# Altium schematic sheet HDMI2_0_RX.SchDoc
size 420 x 297 mm; SheetNumber: 20; SheetTotal: 23
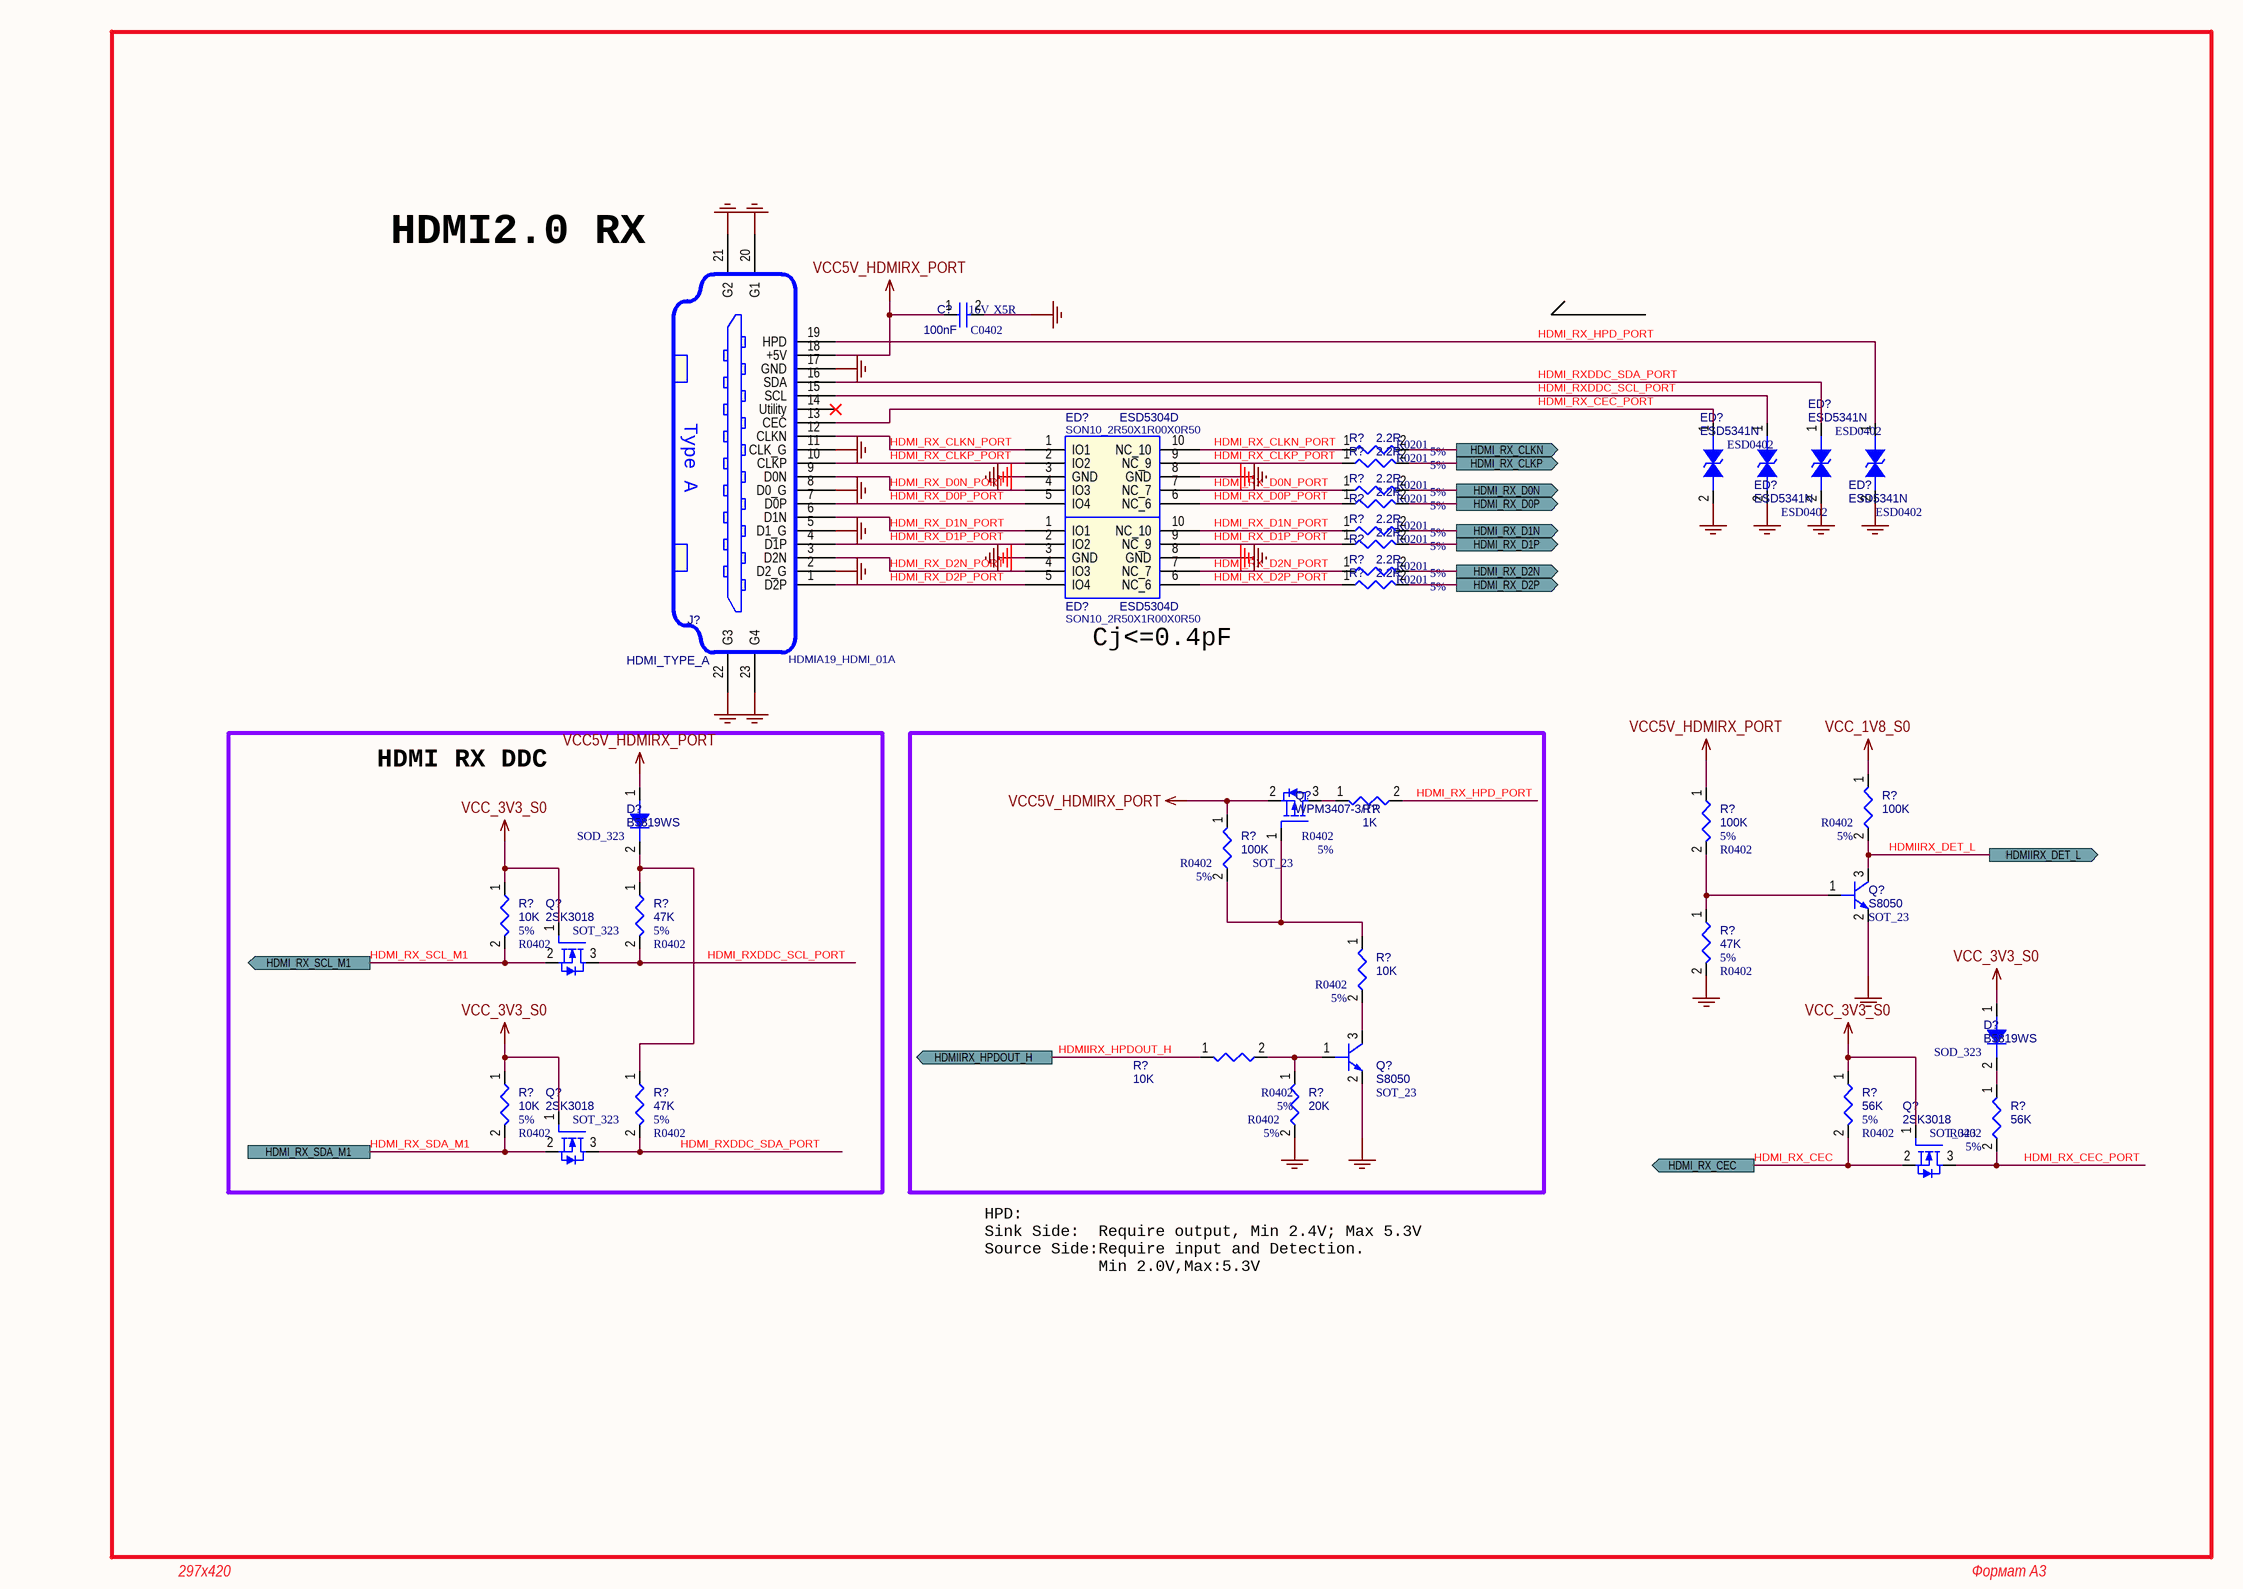
[diagram p0: HDMI2_0_RX.SchDoc]

## Parts
(Parts that share a designator on the sheet are numbered #1, #2 ... from top to bottom, then left to right.)
C?  100nF  Dielectric: X5R  Voltage: 16V  [C0402]
D?#1  B5819WS  [SOD_323]
D?#2  B5819WS  [SOD_323]
ED?#1  ESD5304D  [SON10_2R50X1R00X0R50]
ED?#2  ESD5341N  [ESD0402]
ED?#3  ESD5341N  [ESD0402]
ED?#4  ESD5341N  [ESD0402]
ED?#5  ESD5341N  [ESD0402]
ED?#6  ESD5304D  [SON10_2R50X1R00X0R50]
J?  HDMI_TYPE_A  [HDMIA19_HDMI_01A]
Q?#1  WPM3407-3/TR  PCB Footprint: SOT_23  [SOT23]
Q?#2  S8050  [SOT_23]
Q?#3  2SK3018  PCB Footprint: SOT_323  [SOT23]
Q?#4  S8050  [SOT_23]
Q?#5  2SK3018  PCB Footprint: SOT_323  [SOT23]
Q?#6  2SK3018  PCB Footprint: SOT_323  [SOT23]
R?#1  2.2R  Tolerance: 5%  PCB Footprint: R0201  [R0402]
R?#2  2.2R  Tolerance: 5%  PCB Footprint: R0201  [R0402]
R?#3  2.2R  Tolerance: 5%  PCB Footprint: R0201  [R0402]
R?#4  2.2R  Tolerance: 5%  PCB Footprint: R0201  [R0402]
R?#5  2.2R  Tolerance: 5%  PCB Footprint: R0201  [R0402]
R?#6  2.2R  Tolerance: 5%  PCB Footprint: R0201  [R0402]
R?#7  2.2R  Tolerance: 5%  PCB Footprint: R0201  [R0402]
R?#8  2.2R  Tolerance: 5%  PCB Footprint: R0201  [R0402]
R?#9  1K  Tolerance: 5%  [R0402]
R?#10  100K  Tolerance: 5%  [R0402]
R?#11  100K  Tolerance: 5%  [R0402]
R?#12  100K  Tolerance: 5%  [R0402]
R?#13  10K  Tolerance: 5%  [R0402]
R?#14  47K  Tolerance: 5%  [R0402]
R?#15  47K  Tolerance: 5%  [R0402]
R?#16  10K  Tolerance: 5%  [R0402]
R?#17  10K  Tolerance: 5%  [R0402]
R?#18  10K  Tolerance: 5%  [R0402]
R?#19  47K  Tolerance: 5%  [R0402]
R?#20  20K  Tolerance: 5%  [R0402]
R?#21  56K  Tolerance: 5%  [R0402]
R?#22  56K  Tolerance: 5%  [R0402]

## Blocks framed on the sheet
HDMI RX DDC: D?#1 Q?#3 Q?#5 R?#13 R?#14 R?#18 R?#19

## Ports
HDMI_RX_CEC (out, see RK3588_GPIO_MAYBE_IMPORTANT_PINS[2B]), HDMI_RX_CLKN (out, see RK3588_HDMI[3B]), HDMI_RX_CLKP (out, see RK3588_HDMI[3B]), HDMI_RX_D0N (out, see RK3588_HDMI[3A]), HDMI_RX_D0P (out, see RK3588_HDMI[3A]), HDMI_RX_D1N (out, see RK3588_HDMI[3A]), HDMI_RX_D1P (out, see RK3588_HDMI[3A]), HDMI_RX_D2N (out, see RK3588_HDMI[3B]), HDMI_RX_D2P (out, see RK3588_HDMI[3A]), HDMI_RX_SCL_M1 (out, see RK3588_GPIO_MAYBE_IMPORTANT_PINS[2B]), HDMI_RX_SDA_M1 (see RK3588_GPIO_MAYBE_IMPORTANT_PINS[2B]), HDMIIRX_DET_L (out, see RK3588_BOOTLOADER_MAYBE_SDIO[2B]), HDMIIRX_HPDOUT_H (out, see RK3588_GPIO_MAYBE_IMPORTANT_PINS[2B])

## Nets
GND: C?.2 ED?#1.3(GND) ED?#1.8(GND) ED?#2.2 ED?#3.2 ED?#4.2 ED?#5.2 ED?#6.3(GND) ED?#6.8(GND) J?.2(D2_G) J?.5(D1_G) J?.8(D0_G) J?.11(CLK_G) J?.17(GND) J?.20(G1) J?.21(G2) J?.22(G3) J?.23(G4) Q?#2.2(EMITTER) Q?#4.2(EMITTER) R?#15.2 R?#20.2
VCC5V_HDMIRX_PORT: C?.1 D?#1.1(A) J?.18(+5V) Q?#1.2(SOURCE) R?#11.1 R?#12.1
VCC_1V8_S0: R?#10.1
VCC_3V3_S0: D?#2.1(A) Q?#3.1(GATE) Q?#5.1(GATE) Q?#6.1(GATE) R?#13.1 R?#18.1 R?#21.1
HDMI_RX_CEC: Q?#6.2(SOURCE) R?#21.2 ; port HDMI_RX_CEC
HDMI_RX_CEC_PORT: ED?#2.1 J?.13(CEC) Q?#6.3(DRAIN) R?#22.2
HDMI_RX_CLKN: R?#1.2 ; port HDMI_RX_CLKN
HDMI_RX_CLKN_PORT: ED?#1.1(IO1) ED?#1.10(NC_10) J?.12(CLKN) R?#1.1
HDMI_RX_CLKP: R?#2.2 ; port HDMI_RX_CLKP
HDMI_RX_CLKP_PORT: ED?#1.2(IO2) ED?#1.9(NC_9) J?.10(CLKP) R?#2.1
HDMI_RX_D0N: R?#3.2 ; port HDMI_RX_D0N
HDMI_RX_D0N_PORT: ED?#1.4(IO3) ED?#1.7(NC_7) J?.9(D0N) R?#3.1
HDMI_RX_D0P: R?#4.2 ; port HDMI_RX_D0P
HDMI_RX_D0P_PORT: ED?#1.5(IO4) ED?#1.6(NC_6) J?.7(D0P) R?#4.1
HDMI_RX_D1N: R?#5.2 ; port HDMI_RX_D1N
HDMI_RX_D1N_PORT: ED?#6.1(IO1) ED?#6.10(NC_10) J?.6(D1N) R?#5.1
HDMI_RX_D1P: R?#6.2 ; port HDMI_RX_D1P
HDMI_RX_D1P_PORT: ED?#6.2(IO2) ED?#6.9(NC_9) J?.4(D1P) R?#6.1
HDMI_RX_D2N: R?#7.2 ; port HDMI_RX_D2N
HDMI_RX_D2N_PORT: ED?#6.4(IO3) ED?#6.7(NC_7) J?.3(D2N) R?#7.1
HDMI_RX_D2P: R?#8.2 ; port HDMI_RX_D2P
HDMI_RX_D2P_PORT: ED?#6.5(IO4) ED?#6.6(NC_6) J?.1(D2P) R?#8.1
HDMI_RX_HPD_PORT: ED?#5.1 J?.19(HPD) R?#9.2
HDMI_RX_SCL_M1: Q?#3.2(SOURCE) R?#13.2 ; port HDMI_RX_SCL_M1
HDMI_RX_SDA_M1: Q?#5.2(SOURCE) R?#18.2 ; port HDMI_RX_SDA_M1
HDMI_RXDDC_SCL_PORT: ED?#3.1 J?.15(SCL) Q?#3.3(DRAIN) R?#14.2
HDMI_RXDDC_SDA_PORT: ED?#4.1 J?.16(SDA) Q?#5.3(DRAIN) R?#19.2
HDMIIRX_DET_L: Q?#2.3(COLLECTOR) R?#10.2 ; port HDMIIRX_DET_L
HDMIIRX_HPDOUT_H: R?#17.1 ; port HDMIIRX_HPDOUT_H
NetD?#1_2: D?#1.2(K) R?#14.1 R?#19.1
NetD?#2_2: D?#2.2(K) R?#22.1
NetQ?#1_1: Q?#1.1(GATE) R?#12.2 R?#16.1
NetQ?#1_3: Q?#1.3(DRAIN) R?#9.1
NetQ?#2_1: Q?#2.1(BASE) R?#11.2 R?#15.1
NetQ?#4_1: Q?#4.1(BASE) R?#17.2 R?#20.1
NetQ?#4_3: Q?#4.3(COLLECTOR) R?#16.2

Not connected (* = marked no-connect by the designer): J? 14(Utility)*

## Notes on the sheet
- HDMI2.0 RX
- (near ED?#6) Cj<=0.4pF
- HPD:
  Sink Side:  Require output, Min 2.4V; Max 5.3V
  Source Side:Require input and Detection.
  Min 2.0V,Max:5.3V
- 297x420
- Формат А3
- (in symbol HDMI_TYPE_A_0) Type A

## Library data of the parts
C? = CAP NP_Dup1: cap,100.00nF,+/-10%,16V,X5R,C0402; Part Reference: C4900; Manufacturer PN: C1005X5R1C104K050BA; Manufacturer: TDK; C_Voltage: 10V; Tolerance: 10%; Priority: A; Number: 37; PCB Footprint: C0402; Value: 100nF; Created by: JJJ; Part Type: C0402; RK PN: C1005X5R1C104K050BA
D?#1 = DIODE: Schottky BarrierЈ¬B5819WS SOD-323; Part Reference: D4900; Manufacturer: і¤µз; Priority: A; PCB Footprint: SOD_323; Value: B5819WS; Created by: JJJ; Manufacturer PN: B5819WS; Part Type: Schottky rectifier; RK PN: B5819WS
D?#2 = DIODE: Schottky BarrierЈ¬B5819WS SOD-323; Part Reference: D4901; Manufacturer: і¤µз; Priority: A; PCB Footprint: SOD_323; Value: B5819WS; RK PN: B5819WS; Part Type: Schottky rectifier; Manufacturer PN: B5819WS; Created by: JJJ
ED?#1 = ESD_ESD5304D: 4-Lines, Uni-directional, Ultra-low Capacitance Transient Voltage Suppressors; Part Reference: ED4900; Manufacturer: WillSemi(О¤¶ы°лµјМе); Priority: A; PCB Footprint: SON10_2R50X1R00X0R50; Value: ESD5304D; Created by: JJJ; Manufacturer PN: ESD5304D; Part Type: ESD_TVS; RK PN: ESD5304D
ED?#2 = DIODE BI_DIR TRIG: 1-Line, Bi-directional, Transient Voltage Suppressors.1pF.; Part Reference: ED4901; Manufacturer: WillSemi(О¤¶ы°лµјМе); Priority: A; PCB Footprint: ESD0402; Value: ESD5341N; Created by: JJJ; Manufacturer PN: ESD5341N; Part Type: ESD_TVS; RK PN: ESD5341N
ED?#3 = DIODE BI_DIR TRIG: 1-Line, Bi-directional, Transient Voltage Suppressors.1pF.; Part Reference: ED4902; Manufacturer: WillSemi(О¤¶ы°лµјМе); Priority: A; PCB Footprint: ESD0402; Value: ESD5341N; Created by: JJJ; Manufacturer PN: ESD5341N; Part Type: ESD_TVS; RK PN: ESD5341N
ED?#4 = DIODE BI_DIR TRIG: 1-Line, Bi-directional, Transient Voltage Suppressors.1pF.; Part Reference: ED4903; Manufacturer: WillSemi(О¤¶ы°лµјМе); Priority: A; PCB Footprint: ESD0402; Value: ESD5341N; RK PN: ESD5341N; Part Type: ESD_TVS; Manufacturer PN: ESD5341N; Created by: JJJ
ED?#5 = DIODE BI_DIR TRIG: 1-Line, Bi-directional, Transient Voltage Suppressors.1pF.; Part Reference: ED4904; Manufacturer: WillSemi(О¤¶ы°лµјМе); Priority: A; PCB Footprint: ESD0402; Value: ESD5341N; Created by: JJJ; Manufacturer PN: ESD5341N; Part Type: ESD_TVS; RK PN: ESD5341N
ED?#6 = ESD_ESD5304D: 4-Lines, Uni-directional, Ultra-low Capacitance Transient Voltage Suppressors; Part Reference: ED4905; Manufacturer: WillSemi(О¤¶ы°лµјМе); Priority: A; PCB Footprint: SON10_2R50X1R00X0R50; Value: ESD5304D; Created by: JJJ; Manufacturer PN: ESD5304D; Part Type: ESD_TVS; RK PN: ESD5304D
J? = HDMI_TYPE_A_0: Part Reference: J4900; Value: HDMI_TYPE_A; PCB Footprint: HDMIA19_HDMI_01A
Q?#1 = MOSFET P_Dup1: PMOS,WPM3407-3/TR,SOT_23,Id=4.4A,Vds=30V; Part Reference: Q4901; Manufacturer: WillSemi(О¤¶ы°лµјМе); Pd: 0.9W; Vgsth: 2.0V; VDS: 30V; Vgs: ЎА20V; Id_max: 4.4A; Priority: A; Value: WPM3407-3/TR; Created by: JJJ; Manufacturer PN: WPM3407-3/TR; Part Type: PMOS; RK PN: WPM3407-3/TR
Q?#2 = NPN: S8050,SOT23; Part Reference: Q4900; Manufacturer PN: S8050_SOT23; Manufacturer: і¤µз; Pc: 0.3W; Vceo: 25V; Ic: 0.5A; Priority: A; PCB Footprint: SOT_23; Value: S8050; Created by: JJJ; Part Type: NPN; RK PN: S8050
Q?#3 = MOSFET N_Dup1: NMOS,2SK3018,SOT_323,Id=0.1A,Vds=30V; Part Reference: Q4902; Manufacturer: ROHM; Rds: 5ohm; Priority: A; Id_max: 0.1A; Vgs: 20V; VDS: 30V; Vgsth: 1.5V; Pd: 0.2W; Value: 2SK3018; RK PN: 2SK3018; Part Type: NMOS; Manufacturer PN: 2SK3018; Created by: JJJ
Q?#4 = NPN: S8050,SOT23; Part Reference: Q4903; Manufacturer PN: S8050_SOT23; Manufacturer: і¤µз; Pc: 0.3W; Vceo: 25V; Ic: 0.5A; Priority: A; PCB Footprint: SOT_23; Value: S8050; Created by: JJJ; Part Type: NPN; RK PN: S8050
Q?#5 = MOSFET N_Dup1: NMOS,2SK3018,SOT_323,Id=0.1A,Vds=30V; Part Reference: Q4905; Manufacturer: ROHM; Pd: 0.2W; Vgsth: 1.5V; VDS: 30V; Vgs: 20V; Id_max: 0.1A; Priority: A; Rds: 5ohm; Value: 2SK3018; Created by: JJJ; Manufacturer PN: 2SK3018; Part Type: NMOS; RK PN: 2SK3018
Q?#6 = MOSFET N_Dup1: NMOS,2SK3018,SOT_323,Id=0.1A,Vds=30V; Part Reference: Q4904; Manufacturer: ROHM; Rds: 5ohm; Priority: A; Id_max: 0.1A; Vgs: 20V; VDS: 30V; Vgsth: 1.5V; Pd: 0.2W; Value: 2SK3018; RK PN: 2SK3018; Part Type: NMOS; Manufacturer PN: 2SK3018; Created by: JJJ
R?#1 = RESISTOR_Dup2: НЁУГєсД¤µзЧи,2R2,+/-5%,R0201,1/20W.; Part Reference: R4900; Manufacturer: YAGEO; RK PN: RC0201JR-072R2L; Priority: A; Wattage: 1/20W; Value: 2.2R; Part Type: НЁУГєсД¤µзЧи; Manufacturer PN: RC0201JR-072R2L; Created by: YTL
R?#2 = RESISTOR_Dup2: НЁУГєсД¤µзЧи,2R2,+/-5%,R0201,1/20W.; Part Reference: R4901; Manufacturer PN: RC0201JR-072R2L; Manufacturer: YAGEO; Wattage: 1/20W; Priority: A; Value: 2.2R; Created by: YTL; Part Type: НЁУГєсД¤µзЧи; RK PN: RC0201JR-072R2L
R?#3 = RESISTOR_Dup2: НЁУГєсД¤µзЧи,2R2,+/-5%,R0201,1/20W.; Part Reference: R4902; Manufacturer PN: RC0201JR-072R2L; Manufacturer: YAGEO; Wattage: 1/20W; Priority: A; Value: 2.2R; Created by: YTL; Part Type: НЁУГєсД¤µзЧи; RK PN: RC0201JR-072R2L
R?#4 = RESISTOR_Dup2: НЁУГєсД¤µзЧи,2R2,+/-5%,R0201,1/20W.; Part Reference: R4903; Manufacturer: YAGEO; RK PN: RC0201JR-072R2L; Priority: A; Wattage: 1/20W; Value: 2.2R; Part Type: НЁУГєсД¤µзЧи; Manufacturer PN: RC0201JR-072R2L; Created by: YTL
R?#5 = RESISTOR_Dup2: НЁУГєсД¤µзЧи,2R2,+/-5%,R0201,1/20W.; Part Reference: R4904; Manufacturer PN: RC0201JR-072R2L; Manufacturer: YAGEO; Wattage: 1/20W; Priority: A; Value: 2.2R; Created by: YTL; Part Type: НЁУГєсД¤µзЧи; RK PN: RC0201JR-072R2L
R?#6 = RESISTOR_Dup2: НЁУГєсД¤µзЧи,2R2,+/-5%,R0201,1/20W.; Part Reference: R4905; Manufacturer: YAGEO; RK PN: RC0201JR-072R2L; Priority: A; Wattage: 1/20W; Value: 2.2R; Part Type: НЁУГєсД¤µзЧи; Manufacturer PN: RC0201JR-072R2L; Created by: YTL
R?#7 = RESISTOR_Dup2: НЁУГєсД¤µзЧи,2R2,+/-5%,R0201,1/20W.; Part Reference: R4906; Manufacturer PN: RC0201JR-072R2L; Manufacturer: YAGEO; Wattage: 1/20W; Priority: A; Value: 2.2R; Created by: YTL; Part Type: НЁУГєсД¤µзЧи; RK PN: RC0201JR-072R2L
R?#8 = RESISTOR_Dup2: НЁУГєсД¤µзЧи,2R2,+/-5%,R0201,1/20W.; Part Reference: R4907; Manufacturer: YAGEO; RK PN: RC0201JR-072R2L; Priority: A; Wattage: 1/20W; Value: 2.2R; Part Type: НЁУГєсД¤µзЧи; Manufacturer PN: RC0201JR-072R2L; Created by: YTL
R?#9 = RESISTOR_Dup2: НЁУГєсД¤µзЧи,1K,+/-5%,R0402,1/16W.; Part Reference: R4910; Manufacturer PN: RC0402JR-071KL; Manufacturer: YAGEO; Wattage: 1/16W; Priority: A; PCB Footprint: R0402; Value: 1K; Created by: YTL; Part Type: НЁУГєсД¤µзЧи; RK PN: RC0402JR-071KL
R?#10 = RESISTOR_Dup2: НЁУГєсД¤µзЧи,100K,+/-5%,R0402,1/16W.; Part Reference: R4909; Manufacturer PN: RC0402JR-07100KL; Manufacturer: YAGEO; Wattage: 1/16W; Priority: A; PCB Footprint: R0402; Value: 100K; Created by: YTL; Part Type: НЁУГєсД¤µзЧи; RK PN: RC0402JR-07100KL
R?#11 = RESISTOR_Dup2: НЁУГєсД¤µзЧи,100K,+/-5%,R0402,1/16W.; Part Reference: R4908; Manufacturer: YAGEO; RK PN: RC0402JR-07100KL; Priority: A; Wattage: 1/16W; PCB Footprint: R0402; Value: 100K; Part Type: НЁУГєсД¤µзЧи; Manufacturer PN: RC0402JR-07100KL; Created by: YTL
R?#12 = RESISTOR_Dup2: НЁУГєсД¤µзЧи,100K,+/-5%,R0402,1/16W.; Part Reference: R4912; Manufacturer PN: RC0402JR-07100KL; Manufacturer: YAGEO; Wattage: 1/16W; Priority: A; PCB Footprint: R0402; Value: 100K; Created by: YTL; Part Type: НЁУГєсД¤µзЧи; RK PN: RC0402JR-07100KL
R?#13 = RESISTOR_Dup2: НЁУГєсД¤µзЧи,10K,+/-5%,R0402,1/16W.; Part Reference: R4913; Manufacturer: YAGEO; RK PN: RC0402JR-0710KL; Priority: A; Wattage: 1/16W; PCB Footprint: R0402; Value: 10K; Part Type: НЁУГєсД¤µзЧи; Manufacturer PN: RC0402JR-0710KL; Created by: YTL
R?#14 = RESISTOR_Dup2: НЁУГєсД¤µзЧи,47K,+/-5%,R0402,1/16W.; Part Reference: R4914; Manufacturer PN: RC0402JR-0747KL; Manufacturer: YAGEO; Wattage: 1/16W; Priority: A; PCB Footprint: R0402; Value: 47K; Created by: YTL; Part Type: НЁУГєсД¤µзЧи; RK PN: RC0402JR-0747KL
R?#15 = RESISTOR_Dup2: НЁУГєсД¤µзЧи,47K,+/-5%,R0402,1/16W.; Part Reference: R4911; Manufacturer PN: RC0402JR-0747KL; Manufacturer: YAGEO; Wattage: 1/16W; Priority: A; PCB Footprint: R0402; Value: 47K; Created by: YTL; Part Type: НЁУГєсД¤µзЧи; RK PN: RC0402JR-0747KL
R?#16 = RESISTOR_Dup2: НЁУГєсД¤µзЧи,10K,+/-5%,R0402,1/16W.; Part Reference: R4915; Manufacturer: YAGEO; RK PN: RC0402JR-0710KL; Priority: A; Wattage: 1/16W; PCB Footprint: R0402; Value: 10K; Part Type: НЁУГєсД¤µзЧи; Manufacturer PN: RC0402JR-0710KL; Created by: YTL
R?#17 = RESISTOR_Dup2: НЁУГєсД¤µзЧи,10K,+/-5%,R0402,1/16W.; Part Reference: R4918; Manufacturer PN: RC0402JR-0710KL; Manufacturer: YAGEO; Wattage: 1/16W; Priority: A; PCB Footprint: R0402; Value: 10K; Created by: YTL; Part Type: НЁУГєсД¤µзЧи; RK PN: RC0402JR-0710KL
R?#18 = RESISTOR_Dup2: НЁУГєсД¤µзЧи,10K,+/-5%,R0402,1/16W.; Part Reference: R4919; Manufacturer PN: RC0402JR-0710KL; Manufacturer: YAGEO; Wattage: 1/16W; Priority: A; PCB Footprint: R0402; Value: 10K; Created by: YTL; Part Type: НЁУГєсД¤µзЧи; RK PN: RC0402JR-0710KL
R?#19 = RESISTOR_Dup2: НЁУГєсД¤µзЧи,47K,+/-5%,R0402,1/16W.; Part Reference: R4920; Manufacturer PN: RC0402JR-0747KL; Manufacturer: YAGEO; Wattage: 1/16W; Priority: A; PCB Footprint: R0402; Value: 47K; Created by: YTL; Part Type: НЁУГєсД¤µзЧи; RK PN: RC0402JR-0747KL
R?#20 = RESISTOR_Dup2: НЁУГєсД¤µзЧи,20K,+/-5%,R0402,1/16W.; Part Reference: R4921; Manufacturer: YAGEO; RK PN: RC0402JR-0720KL; Priority: A; Wattage: 1/16W; PCB Footprint: R0402; Value: 20K; Part Type: НЁУГєсД¤µзЧи; Manufacturer PN: RC0402JR-0720KL; Created by: YTL
R?#21 = RESISTOR_Dup2: НЁУГєсД¤µзЧи,56K,+/-5%,R0402,1/16W.; Part Reference: R4916; Manufacturer PN: RC0402JR-0756KL; Manufacturer: YAGEO; Wattage: 1/16W; Priority: A; PCB Footprint: R0402; Value: 56K; Created by: YTL; Part Type: НЁУГєсД¤µзЧи; RK PN: RC0402JR-0756KL
R?#22 = RESISTOR_Dup2: НЁУГєсД¤µзЧи,56K,+/-5%,R0402,1/16W.; Part Reference: R4917; Manufacturer: YAGEO; RK PN: RC0402JR-0756KL; Priority: A; Wattage: 1/16W; PCB Footprint: R0402; Value: 56K; Part Type: НЁУГєсД¤µзЧи; Manufacturer PN: RC0402JR-0756KL; Created by: YTL